# EAGLE schematic Secondary_Board_1.0 (EAGLE 9.4.2)
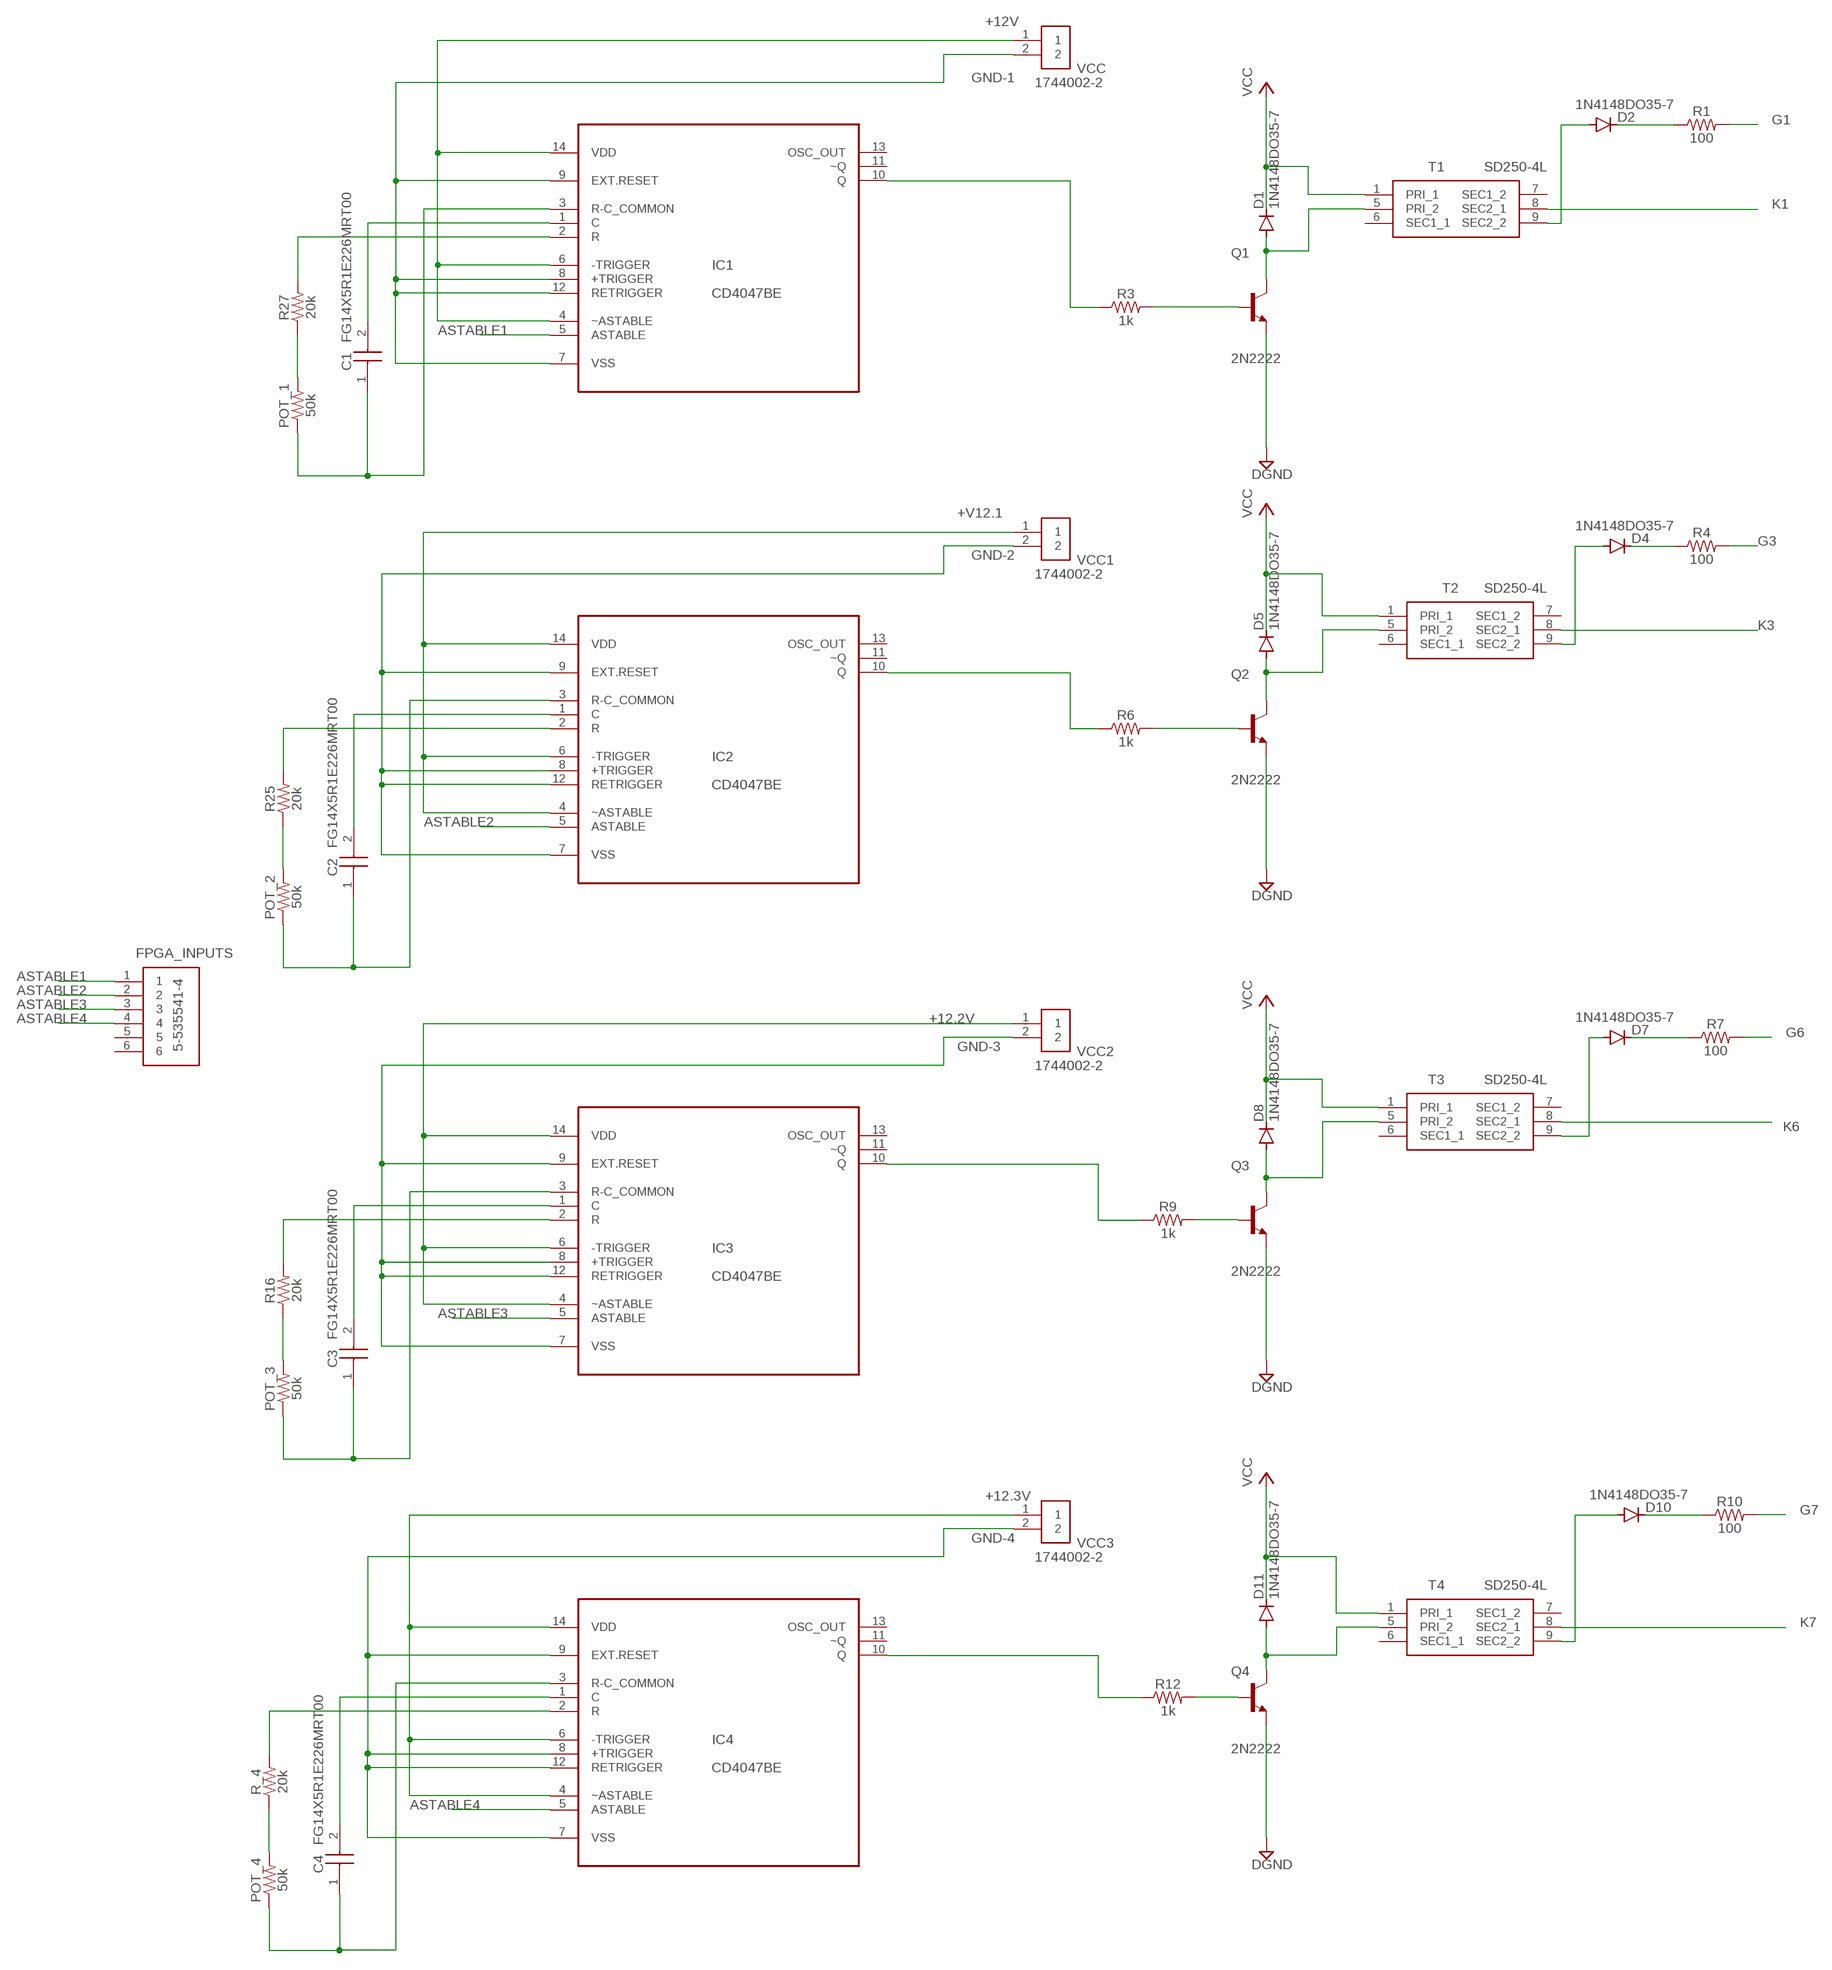
[diagram p0: schematic, sheet 1, part 1 of 2]
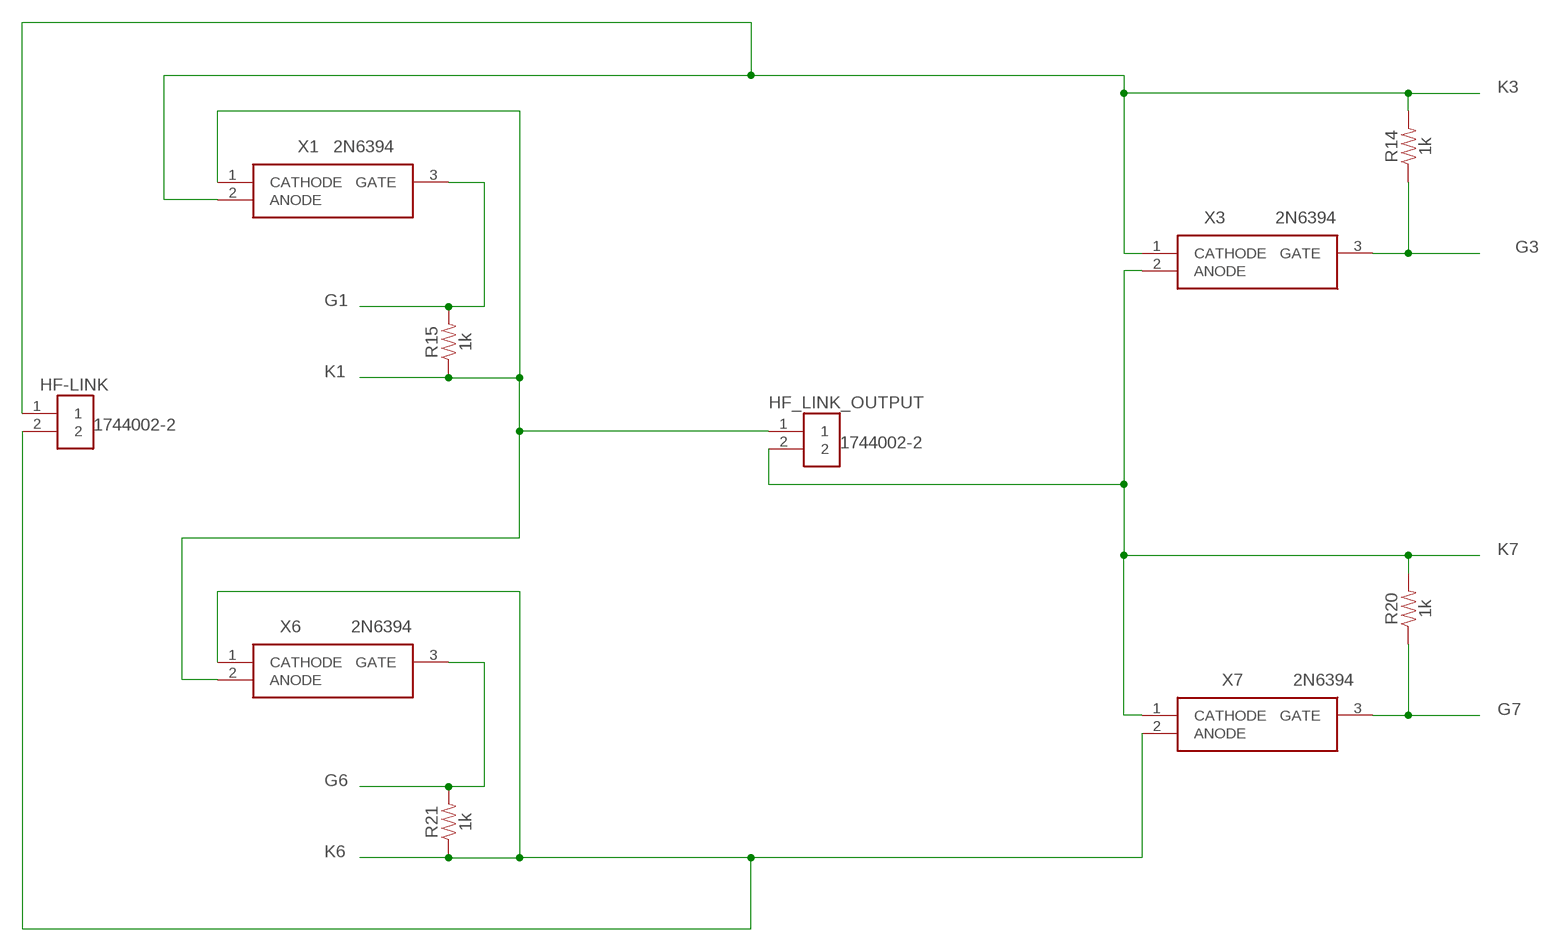
[diagram p1: schematic, sheet 1, part 2 of 2]

## Parts
C1  FG14X5R1E226MRT00  [CAPPRD550W50D395H550]
C2  FG14X5R1E226MRT00  [CAPPRD550W50D395H550]
C3  FG14X5R1E226MRT00  [CAPPRD550W50D395H550]
C4  FG14X5R1E226MRT00  [CAPPRD550W50D395H550]
D1  1N4148DO35-7  [DO35-7]
D2  1N4148DO35-7  [DO35-7]
D4  1N4148DO35-7  [DO35-7]
D5  1N4148DO35-7  [DO35-7]
D7  1N4148DO35-7  [DO35-7]
D8  1N4148DO35-7  [DO35-7]
D10  1N4148DO35-7  [DO35-7]
D11  1N4148DO35-7  [DO35-7]
FPGA_INPUTS  5-535541-4  [SHDR6W76P0X254_1X6_1524X356X62]
HF-LINK  1744002-2  [CONN_1744002-2]
HF_LINK_OUTPUT  1744002-2  [CONN_1744002-2]
IC1  CD4047BE  [DIP254P762X508-14]
IC2  CD4047BE  [DIP254P762X508-14]
IC3  CD4047BE  [DIP254P762X508-14]
IC4  CD4047BE  [DIP254P762X508-14]
POT_1  50k  1KOHM-HORIZ-1/4W-1%  [AXIAL-0.3]
POT_2  50k  1KOHM-HORIZ-1/4W-1%  [AXIAL-0.3]
POT_3  50k  1KOHM-HORIZ-1/4W-1%  [AXIAL-0.3]
POT_4  50k  1KOHM-HORIZ-1/4W-1%  [AXIAL-0.3]
Q1  2N2222  [TO127P584H533-3]
Q2  2N2222  [TO127P584H533-3]
Q3  2N2222  [TO127P584H533-3]
Q4  2N2222  [TO127P584H533-3]
R1  100  100OHM-HORIZ-1/4W-1%  [AXIAL-0.3]
R3  1k  1KOHM-HORIZ-1/4W-1%  [AXIAL-0.3]
R4  100  100OHM-HORIZ-1/4W-1%  [AXIAL-0.3]
R6  1k  1KOHM-HORIZ-1/4W-1%  [AXIAL-0.3]
R7  100  100OHM-HORIZ-1/4W-1%  [AXIAL-0.3]
R9  1k  1KOHM-HORIZ-1/4W-1%  [AXIAL-0.3]
R10  100  100OHM-HORIZ-1/4W-1%  [AXIAL-0.3]
R12  1k  1KOHM-HORIZ-1/4W-1%  [AXIAL-0.3]
R14  1k  1KOHM-HORIZ-1/4W-1%  [AXIAL-0.3]
R15  1k  1KOHM-HORIZ-1/4W-1%  [AXIAL-0.3]
R16  20k  1KOHM-HORIZ-1/4W-1%  [AXIAL-0.3]
R20  1k  1KOHM-HORIZ-1/4W-1%  [AXIAL-0.3]
R21  1k  1KOHM-HORIZ-1/4W-1%  [AXIAL-0.3]
R25  20k  1KOHM-HORIZ-1/4W-1%  [AXIAL-0.3]
R27  20k  1KOHM-HORIZ-1/4W-1%  [AXIAL-0.3]
R_4  20k  1KOHM-HORIZ-1/4W-1%  [AXIAL-0.3]
T1  SD250-4L  [SD2504L]
T2  SD250-4L  [SD2504L]
T3  SD250-4L  [SD2504L]
T4  SD250-4L  [SD2504L]
VCC  1744002-2  [CONN_1744002-2]
VCC1  1744002-2  [CONN_1744002-2]
VCC2  1744002-2  [CONN_1744002-2]
VCC3  1744002-2  [CONN_1744002-2]
X1  2N6394  [TO254P482X997X2018-3P]
X3  2N6394  [TO254P482X997X2018-3P]
X6  2N6394  [TO254P482X997X2018-3P]
X7  2N6394  [TO254P482X997X2018-3P]

## Nets
+12.2V: IC3.4(~ASTABLE) IC3.6(-TRIGGER) IC3.14(VDD) VCC2.1
+12.3V: IC4.4(~ASTABLE) IC4.6(-TRIGGER) IC4.14(VDD) VCC3.1
+12V: IC1.4(~ASTABLE) IC1.6(-TRIGGER) IC1.14(VDD) VCC.1
+V12.1: IC2.4(~ASTABLE) IC2.6(-TRIGGER) IC2.14(VDD) VCC1.1
ASTABLE1: FPGA_INPUTS.1 IC1.5(ASTABLE)
ASTABLE2: FPGA_INPUTS.2 IC2.5(ASTABLE)
ASTABLE3: FPGA_INPUTS.3 IC3.5(ASTABLE)
ASTABLE4: FPGA_INPUTS.4 IC4.5(ASTABLE)
DGND: Q1.1(E) Q2.1(E) Q3.1(E) Q4.1(E)
G1: R1.P$2 R15.P$2 X1.3(GATE)
G3: R4.P$2 R14.P$1 X3.3(GATE)
G6: R7.P$2 R21.P$2 X6.3(GATE)
G7: R10.P$2 R20.P$1 X7.3(GATE)
GND-1: IC1.7(VSS) IC1.8(+TRIGGER) IC1.9(EXT.RESET) IC1.12(RETRIGGER) VCC.2
GND-2: IC2.7(VSS) IC2.8(+TRIGGER) IC2.9(EXT.RESET) IC2.12(RETRIGGER) VCC1.2
GND-3: IC3.7(VSS) IC3.8(+TRIGGER) IC3.9(EXT.RESET) IC3.12(RETRIGGER) VCC2.2
GND-4: IC4.7(VSS) IC4.8(+TRIGGER) IC4.9(EXT.RESET) IC4.12(RETRIGGER) VCC3.2
K1: HF_LINK_OUTPUT.1 R15.P$1 T1.8(SEC2_1) X1.1(CATHODE) X6.2(ANODE)
K3: HF-LINK.1 R14.P$2 T2.8(SEC2_1) X1.2(ANODE) X3.1(CATHODE)
K6: HF-LINK.2 R21.P$1 T3.8(SEC2_1) X6.1(CATHODE) X7.2(ANODE)
K7: HF_LINK_OUTPUT.2 R20.P$2 T4.8(SEC2_1) X3.2(ANODE) X7.1(CATHODE)
N$1: D5.A Q2.3(C) T2.5(PRI_2)
N$2: D1.A Q1.3(C) T1.5(PRI_2)
N$3: D2.C R1.P$1
N$4: IC1.10(Q) R3.P$1
N$5: Q1.2(B) R3.P$2
N$6: D4.A T2.9(SEC2_2)
N$7: IC2.10(Q) R6.P$1
N$8: IC3.10(Q) R9.P$1
N$9: IC4.10(Q) R12.P$1
N$11: D4.C R4.P$1
N$12: D7.A T3.9(SEC2_2)
N$13: Q2.2(B) R6.P$2
N$14: D10.A T4.9(SEC2_2)
N$15: D2.A T1.9(SEC2_2)
N$21: D8.A Q3.3(C) T3.5(PRI_2)
N$24: D7.C R7.P$1
N$25: IC1.2(R) R27.P$2
N$26: POT_1.P$2 R27.P$1
N$27: C1.2(-) IC1.1(C)
N$28: C1.1(+) IC1.3(R-C_COMMON) POT_1.P$1
N$30: IC2.2(R) R25.P$2
N$31: POT_2.P$2 R25.P$1
N$32: C2.2(-) IC2.1(C)
N$33: Q3.2(B) R9.P$2
N$34: C2.1(+) IC2.3(R-C_COMMON) POT_2.P$1
N$36: D11.A Q4.3(C) T4.5(PRI_2)
N$37: D10.C R10.P$1
N$38: IC3.2(R) R16.P$2
N$39: Q4.2(B) R12.P$2
N$40: POT_3.P$2 R16.P$1
N$41: C3.2(-) IC3.1(C)
N$42: C3.1(+) IC3.3(R-C_COMMON) POT_3.P$1
N$44: IC4.2(R) R_4.P$2
N$45: POT_4.P$2 R_4.P$1
N$46: C4.2(-) IC4.1(C)
N$47: C4.1(+) IC4.3(R-C_COMMON) POT_4.P$1
VCC: D1.C D5.C D8.C D11.C T1.1(PRI_1) T2.1(PRI_1) T3.1(PRI_1) T4.1(PRI_1)
Unconnected: FPGA_INPUTS.5 FPGA_INPUTS.6 IC1.11(~Q) IC1.13(OSC_OUT) IC2.11(~Q) IC2.13(OSC_OUT) IC3.11(~Q) IC3.13(OSC_OUT) IC4.11(~Q) IC4.13(OSC_OUT) T1.6(SEC1_1) T1.7(SEC1_2) T2.6(SEC1_1) T2.7(SEC1_2) T3.6(SEC1_1) T3.7(SEC1_2) T4.6(SEC1_1) T4.7(SEC1_2)

## Library data of the parts
C1-C4 = FG14X5R1E226MRT00:FG14X5R1E226MRT00: Multilayer Ceramic Capacitors MLCC - Leaded RAD 25V 22uF X5R 20% LS:2.5mm Source: Datasheet <https://mouser.componentsearchengine.com/Datasheets/1/FG14X5R1E226MRT00.pdf>; DESCRIPTION: Multilayer Ceramic Capacitors MLCC - Leaded RAD 25V 22uF X5R 20% LS:2.5mm; HEIGHT: 5.5mm; MANUFACTURER_NAME: TDK; MANUFACTURER_PART_NUMBER: FG14X5R1E226MRT00
D1 D2 D4 D5 D7 D8 D10 D11 = diode:1N4148: DIODE high speed (Philips)
FPGA_INPUTS = 5-535541-4:5-535541-4: AMP - TE CONNECTIVITY - 5-535541-4 - BOARD-BOARD CONNECTOR, RECEPTACLE, 6 POSITION, 1ROW Source: Datasheet <http://www.te.com/commerce/DocumentDelivery/DDEController?Action=showdoc&DocId=Customer Drawing535541N6pdfEnglishENG_CD_535541_N6.pdf5-535541-4>; ALLIED_NUMBER: 71210170; ALLIED_PRICE-STOCK: https://www.alliedelec.com/te-connectivity-5-535541-4/71210170/; DESCRIPTION: AMP - TE CONNECTIVITY - 5-535541-4 - BOARD-BOARD CONNECTOR, RECEPTACLE, 6 POSITION, 1ROW; HEIGHT: 6.22mm; MANUFACTURER_NAME: TE Connectivity; MANUFACTURER_PART_NUMBER: 5-535541-4; MOUSER_PART_NUMBER: 571-5-535541-4; MOUSER_PRICE-STOCK: https://www.mouser.com/Search/Refine.aspx?Keyword=571-5-535541-4
HF-LINK HF_LINK_OUTPUT VCC VCC1-VCC3 = 1744002-2:1744002-2: CONN HEADER VERT 2POS 3.96MM; AVAILABILITY: Unavailable; DESCRIPTION: CONN HEADER VERT 2POS 3.96MM; MF: TE Connectivity; MP: 1744002-2; PACKAGE: None; PRICE: None; TE_PURCHASE_URL: https://www.te.com/usa-en/product-1744002-2.html?te_bu=Cor&te_type=disp&te_campaign=seda_glo_cor-seda-global-disp-prtnr-fy19-seda-model-bom-cta_sma-317_1&elqCampaignId=32493
IC1-IC4 = CD4047BE:CD4047BE: CMOS Low Power Monostable/Astable Multivibrator; AVAILABILITY: Unavailable; DESCRIPTION: CMOS Low-Power Monostable/Astable Multivibrator 14-PDIP -55 to 125; MF: Texas Instruments; MP: CD4047BE; PACKAGE: DIP-14 Texas Instruments; PRICE: None
POT_1-POT_4 R16 R25 R27 R_4 = SparkFun-Resistors:1KOHM: 1kΩ resistor A resistor is a passive two-terminal electrical component that implements electrical resistance as a circuit element. Resistors act to reduce current flow, and, at the same time, act to lower voltage levels within circuits. - Wikipedia; PROD_ID: RES-12182; VALUE: 1k
Q1-Q4 = 2N2222:2N2222: Trans Npn 30v 0.8a To-18; AVAILABILITY: Unavailable; DESCRIPTION: Silicon Transistor NPN , BULK; MF: Central Semiconductor; MP: 2N2222; PACKAGE: TO-18 Central Semiconductor; PRICE: None
R1 R4 R7 R10 = SparkFun-Resistors:100OHM: 100Ω resistor A resistor is a passive two-terminal electrical component that implements electrical resistance as a circuit element. Resistors act to reduce current flow, and, at the same time, act to lower voltage levels within circuits. - Wikipedia; PROD_ID: RES-12181
R3 R6 R9 R12 R14 R15 R20 R21 = SparkFun-Resistors:1KOHM: 1kΩ resistor A resistor is a passive two-terminal electrical component that implements electrical resistance as a circuit element. Resistors act to reduce current flow, and, at the same time, act to lower voltage levels within circuits. - Wikipedia; PROD_ID: RES-12182
T1-T4 = SD250-4L:SD250-4L: Base/Gate Driver Transformers. Lower cost than toroidal equivalents Frequency range of 10 250 kHz and up Industry standard pin centers 3750 Vrms, one minute isolation (hipot) between primary and secondary windings; 1500 Vrms, one minute between secondaries UL1446 Class B (130C) Insulation System (UL File E83628) Source: Datasheet <https://www.coilcraft.com/pdfs/pwrbase.pdf>; DESCRIPTION: Base/Gate Driver Transformers. Lower cost than toroidal equivalents Frequency range of 10 250 kHz and up Industry standard pin centers 3750 Vrms, one minute isolation (hipot) between primary and secondary windings; 1500 Vrms, one minute between secondaries UL1446 Class B (130C) Insulation System (UL File E83628); HEIGHT: 24.13mm; MANUFACTURER_NAME: COILCRAFT; MANUFACTURER_PART_NUMBER: SD250-4L
X1 X3 X6 X7 = 2N6394:2N6394: SCRs 50V 12A Source: Datasheet <https://www.mouser.com/datasheet/2/308/2N6394-D-103254.pdf>; DESCRIPTION: SCRs 50V 12A; HEIGHT: 4.82mm; MANUFACTURER_NAME: ON Semiconductor; MANUFACTURER_PART_NUMBER: 2N6394; MOUSER_PART_NUMBER: 863-2N6394; MOUSER_PRICE-STOCK: https://www.mouser.com/Search/Refine.aspx?Keyword=863-2N6394